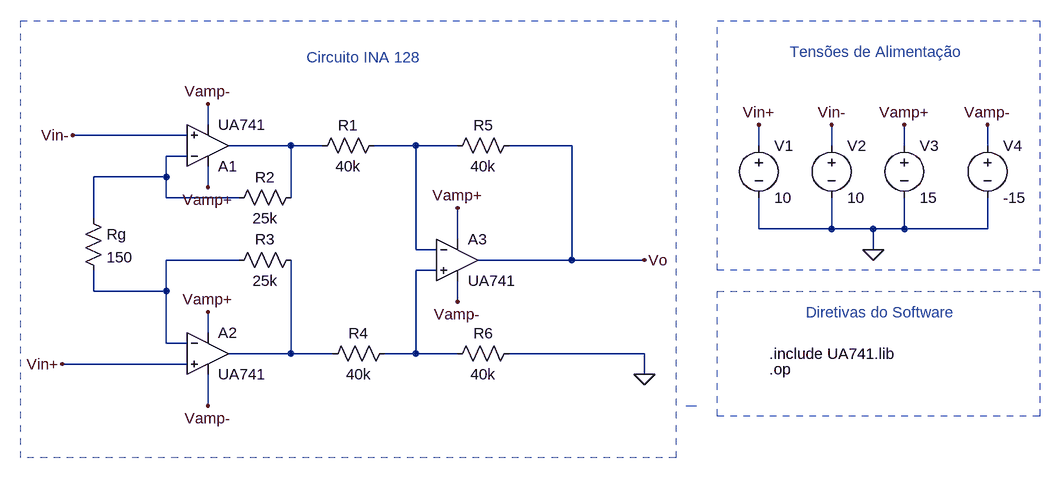
[diagram p0: schematic Trabalho1_Simu_2A.asc]
Trabalho1_Simu_2A.asc, the LTspice schematic file:
Version 4
SHEET 1 1060 680
WIRE -224 -176 -224 -208
WIRE -256 -160 -432 -160
WIRE -96 -144 -192 -144
WIRE -48 -144 -96 -144
WIRE 96 -144 32 -144
WIRE 160 -144 96 -144
WIRE 336 -144 240 -144
WIRE 624 -144 624 -176
WIRE 736 -144 736 -176
WIRE 848 -144 848 -176
WIRE 976 -144 976 -176
WIRE -256 -128 -288 -128
WIRE -288 -96 -288 -128
WIRE -288 -96 -400 -96
WIRE -224 -80 -224 -112
WIRE -288 -64 -288 -96
WIRE -176 -64 -288 -64
WIRE -96 -64 -96 -144
WIRE -400 -32 -400 -96
WIRE 624 -16 624 -64
WIRE 736 -16 736 -64
WIRE 736 -16 624 -16
WIRE 800 -16 736 -16
WIRE 848 -16 848 -64
WIRE 848 -16 800 -16
WIRE 976 -16 976 -64
WIRE 976 -16 848 -16
WIRE 160 0 160 -48
WIRE 96 16 96 -144
WIRE 128 16 96 16
WIRE 800 16 800 -16
WIRE -176 32 -288 32
WIRE 336 32 336 -144
WIRE 336 32 192 32
WIRE 448 32 336 32
WIRE 128 48 96 48
WIRE -400 80 -400 48
WIRE -288 80 -288 32
WIRE -288 80 -400 80
WIRE 160 96 160 64
WIRE -224 144 -224 112
WIRE -288 160 -288 80
WIRE -256 160 -288 160
WIRE -96 176 -96 32
WIRE -96 176 -192 176
WIRE -32 176 -96 176
WIRE 96 176 96 48
WIRE 96 176 48 176
WIRE 160 176 96 176
WIRE 448 176 240 176
WIRE -256 192 -448 192
WIRE 448 208 448 176
WIRE -224 256 -224 208
FLAG 448 32 Vo
FLAG 624 -176 Vin+
FLAG 736 -176 Vin-
FLAG 848 -176 Vamp+
FLAG 976 -176 Vamp-
FLAG 800 16 0
FLAG -448 192 Vin+
FLAG -432 -160 Vin-
FLAG 448 208 0
FLAG 160 -48 Vamp+
FLAG -224 -80 Vamp+
FLAG -224 112 Vamp+
FLAG -224 -208 Vamp-
FLAG 160 96 Vamp-
FLAG -224 256 Vamp-
SYMBOL res 48 -160 R90
WINDOW 0 0 56 VBottom 2
WINDOW 3 32 56 VTop 2
SYMATTR InstName R1
SYMATTR Value 40k
SYMBOL res -80 -80 R90
WINDOW 0 0 56 VBottom 2
WINDOW 3 32 56 VTop 2
SYMATTR InstName R2
SYMATTR Value 25k
SYMBOL res -80 16 R90
WINDOW 0 0 56 VBottom 2
WINDOW 3 32 56 VTop 2
SYMATTR InstName R3
SYMATTR Value 25k
SYMBOL res 64 160 R90
WINDOW 0 0 56 VBottom 2
WINDOW 3 32 56 VTop 2
SYMATTR InstName R4
SYMATTR Value 40k
SYMBOL res 256 -160 R90
WINDOW 0 0 56 VBottom 2
WINDOW 3 32 56 VTop 2
SYMATTR InstName R5
SYMATTR Value 40k
SYMBOL res 256 160 R90
WINDOW 0 0 56 VBottom 2
WINDOW 3 32 56 VTop 2
SYMATTR InstName R6
SYMATTR Value 40k
SYMBOL res -416 -48 R0
SYMATTR InstName Rg
SYMATTR Value 150
SYMBOL OpAmps\\opamp2 -224 112 R0
SYMATTR InstName A2
SYMATTR Value UA741
SYMBOL OpAmps\\opamp2 160 -32 R0
SYMATTR InstName A3
SYMATTR Value UA741
SYMBOL OpAmps\\opamp2 -224 -80 M180
SYMATTR InstName A1
SYMATTR Value UA741
SYMBOL voltage 624 -160 R0
WINDOW 123 0 0 Left 0
WINDOW 39 0 0 Left 0
SYMATTR InstName V1
SYMATTR Value 10
SYMBOL voltage 736 -160 R0
WINDOW 123 0 0 Left 0
WINDOW 39 0 0 Left 0
SYMATTR InstName V2
SYMATTR Value 10
SYMBOL voltage 848 -160 R0
WINDOW 123 0 0 Left 0
WINDOW 39 0 0 Left 0
SYMATTR InstName V3
SYMATTR Value 15
SYMBOL voltage 976 -160 R0
WINDOW 123 0 0 Left 0
WINDOW 39 0 0 Left 0
SYMATTR InstName V4
SYMATTR Value -15
TEXT 672 -288 Left 2 ;Tensões de Alimentação
TEXT -72 -280 Left 2 ;Circuito INA 128
TEXT 696 112 Left 2 ;Diretivas do Software
TEXT 640 200 Left 2 !.op
TEXT 640 176 Left 2 !.include UA741.lib
LINE Normal 528 256 528 256 2
LINE Normal 512 256 528 256 2
RECTANGLE Normal 1056 48 560 -336 2
RECTANGLE Normal 496 336 -512 -336 2
RECTANGLE Normal 1056 272 560 80 2

The netlist it stands for:
* Trabalho1_Simu_2A.asc
R1 N002 N001 40k
R2 N001 N003 25k
R3 N006 N004 25k
R4 N005 N006 40k
R5 Vo N002 40k
R6 0 N005 40k
Rg N003 N004 150
XA2 Vin+ N004 Vamp+ Vamp- N006 UA741  ; pins In+ In- V+ V- OUT
XA3 N005 N002 Vamp+ Vamp- Vo UA741  ; pins In+ In- V+ V- OUT
XA1 Vin- N003 Vamp+ Vamp- N001 UA741  ; pins In+ In- V+ V- OUT
V1 Vin+ 0 10
V2 Vin- 0 10
V3 Vamp+ 0 15
V4 Vamp- 0 -15
* Tensões de Alimentação
* Circuito INA 128
* Diretivas do Software
.op
.include UA741.lib
.backanno
.end